# Altium schematic sheet 06_ETHERNET.SchDoc: RMII 10/100Mbps Ethernet
size 381 x 266 mm; Organization: Meteroi; Address1: Room 428, 410 Guiping Rd.; Address2: Shanghai 200233, CHINA; SheetNumber: 6; SheetTotal: 9; PageSetup: Record=PageOptions|CenterHorizontal=True|CenterVertical=True|PrintScale=0.75|XCorrection=1.00|YCorrection=1.00|PrintKind=2|BorderSize=5000000|LeftOffset=0|BottomOffset=0|Orientation=2|PaperLength=1000|PaperWidth=1000|Scale=100|PaperSource=276|PrintQuality=-3|MediaType=1|DitherType=10|PaperKind=A4|PrintScaleMode=1
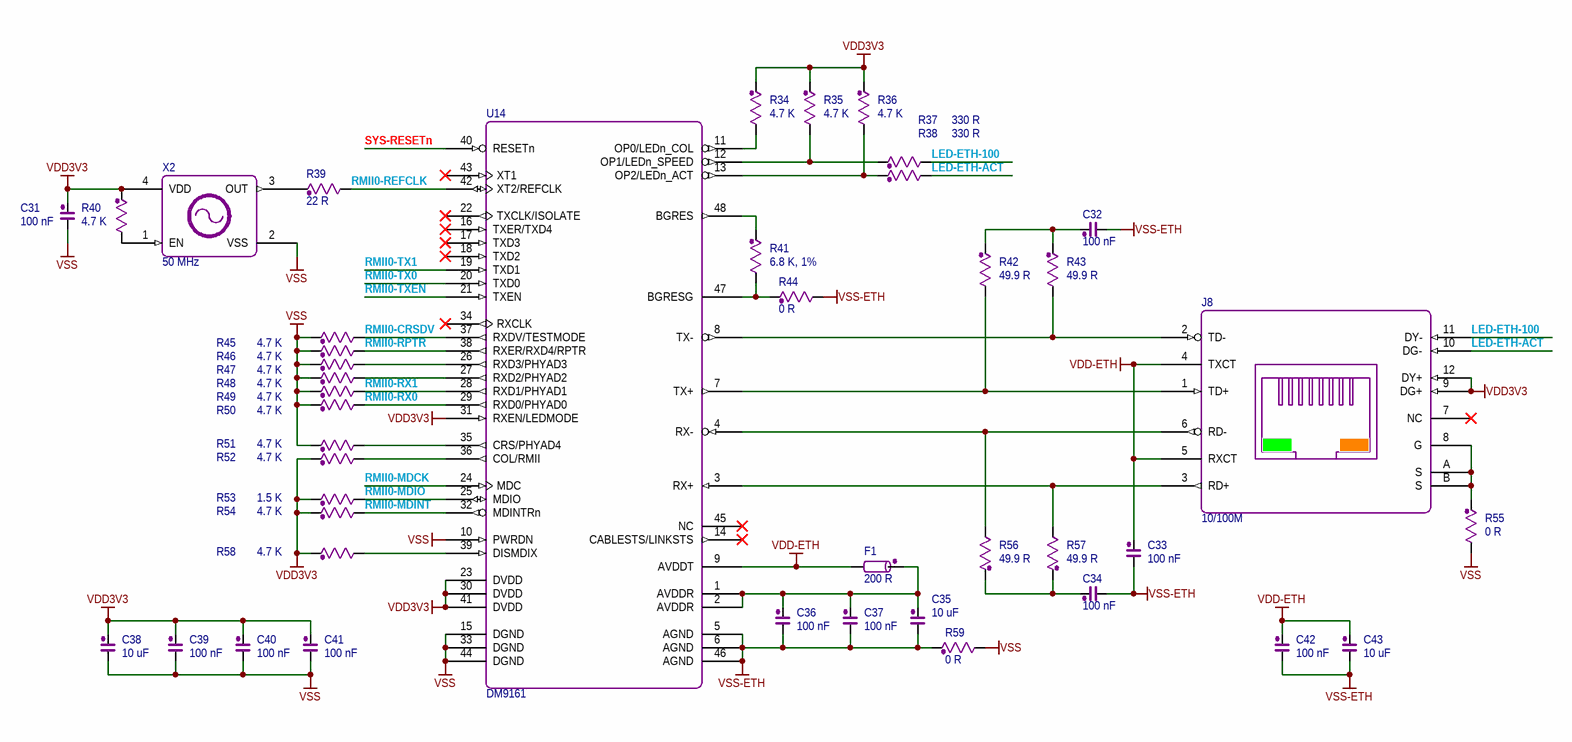
[diagram p0: 06_ETHERNET.SchDoc]

## Parts
C31  100 nF  [0402A1]
C32  100 nF  [0603A1]
C33  100 nF  [0603A1]
C34  100 nF  [0603A1]
C35  10 uF  [0603A1]
C36  100 nF  [0402A1]
C37  100 nF  [0402A1]
C38  10 uF  [0603A1]
C39  100 nF  [0402A1]
C40  100 nF  [0402A1]
C41  100 nF  [0402A1]
C42  100 nF  [0402A1]
C43  10 uF  [0603A1]
F1  200 R  [0603A3]
J8  10/100M  [RJ45_JACK_B]
R34  4.7 K  [0402A2]
R35  4.7 K  [0402A2]
R36  4.7 K  [0402A2]
R37  330 R  [0402A2]
R38  330 R  [0402A2]
R39  22 R  [0402A2]
R40  4.7 K  [0402A2]
R41  6.8 K, 1%  [0603A2]
R42  49.9 R  [0603A2]
R43  49.9 R  [0603A2]
R44  0 R  [0402A2]
R45  4.7 K  [0402A2]
R46  4.7 K  [0402A2]
R47  4.7 K  [0402A2]
R48  4.7 K  [0402A2]
R49  4.7 K  [0402A2]
R50  4.7 K  [0402A2]
R51  4.7 K  [0402A2]
R52  4.7 K  [0402A2]
R53  1.5 K  [0402A2]
R54  4.7 K  [0402A2]
R55  0 R  [0603A2]
R56  49.9 R  [0603A2]
R57  49.9 R  [0603A2]
R58  4.7 K  [0402A2]
R59  0 R  [0603A2]
U14  DM9161  [TQFP-48A]
X2  50 MHz  [OSC_4B_S_5032]

## Nets
VDD3V3: C31.2 C38.2 C39.2 C40.2 C41.2 J8.9(DG+) J8.12(DY+) R34.2 R35.2 R36.2 R40.2 R52.2 R53.2 R54.2 R58.2 U14.23(DVDD) U14.30(DVDD) U14.31(RXEN/LEDMODE) U14.41(DVDD) X2.4(VDD)
VDD-ETH: C33.2 C42.2 C43.2 F1.1 J8.4(TXCT) J8.5(RXCT) U14.9(AVDDT)
VSS: C31.1 C38.1 C39.1 C40.1 C41.1 R45.2 R46.2 R47.2 R48.2 R49.2 R50.2 R51.2 R55.1 R59.1 U14.10(PWRDN) U14.15(DGND) U14.33(DGND) U14.44(DGND) X2.2(VSS)
VSS-ETH: C32.1 C33.1 C34.1 C35.1 C36.1 C37.1 C42.1 C43.1 R44.1 R59.2 U14.5(AGND) U14.6(AGND) U14.46(AGND)
LED-ETH-100: J8.11(DY-) R37.1
LED-ETH-ACT: J8.10(DG-) R38.1
RMII0-CRSDV: R45.1 U14.37(RXDV/TESTMODE)
RMII0-MDCK: U14.24(MDC)
RMII0-MDINT: R54.1 U14.32(MDINTRn)
RMII0-MDIO: R53.1 U14.25(MDIO)
RMII0-REFCLK: R39.1 U14.42(XT2/REFCLK)
RMII0-RPTR: R46.1 U14.38(RXER/RXD4/RPTR)
RMII0-RX0: R50.1 U14.29(RXD0/PHYAD0)
RMII0-RX1: R49.1 U14.28(RXD1/PHYAD1)
RMII0-TX0: U14.20(TXD0)
RMII0-TX1: U14.19(TXD1)
RMII0-TXEN: U14.21(TXEN)
SYS-RESETn: U14.40(RESETn)
NetC32_2: C32.2 R42.2 R43.2
NetC34_2: C34.2 R56.2 R57.2
NetC35_2: C35.2 C36.2 C37.2 F1.2 U14.1(AVDDR) U14.2(AVDDR)
NetJ8_1: J8.1(TD+) R42.1 U14.7(TX+)
NetJ8_2: J8.2(TD-) R43.1 U14.8(TX-)
NetJ8_3: J8.3(RD+) R57.1 U14.3(RX+)
NetJ8_6: J8.6(RD-) R56.1 U14.4(RX-)
NetJ8_8: J8.8(G) J8.A(S) J8.B(S) R55.2
NetR34_1: R34.1 U14.11(OP0/LEDn_COL)
NetR35_1: R35.1 R37.2 U14.12(OP1/LEDn_SPEED)
NetR36_1: R36.1 R38.2 U14.13(OP2/LEDn_ACT)
NetR39_2: R39.2 X2.3(OUT)
NetR40_1: R40.1 X2.1(EN)
NetR41_1: R41.1 R44.2 U14.47(BGRESG)
NetR41_2: R41.2 U14.48(BGRES)
NetR47_1: R47.1 U14.26(RXD3/PHYAD3)
NetR48_1: R48.1 U14.27(RXD2/PHYAD2)
NetR51_1: R51.1 U14.35(CRS/PHYAD4)
NetR52_1: R52.1 U14.36(COL/RMII)
NetR58_1: R58.1 U14.39(DISMDIX)

Not connected (* = marked no-connect by the designer): J8 7(NC)*; U14 14(CABLESTS/LINKSTS)* 16(TXER/TXD4)* 17(TXD3)* 18(TXD2)* 22(TXCLK/ISOLATE)* 34(RXCLK)* 43(XT1)* 45(NC)*

## Notes on the sheet
- Title:
- Project:
- Sheet:
- Of
- Size:
- D/N:
- Rev:
- Date:
- P/N:
- S/N:
- Designer:
- C

## Library data of the parts
C31-C43 = CAP: Normal Capacitor; PartNumber: 0; Vendor: muRata; Designer: shyul; PinCountSMD: 2; SerialNumber: 0; Publisher: Cowin; PCBMarker: Capacitor; Version: 1.0; VersionDate: 04-27-2011; PinCountHole: 0
  C31-C34 C36 C37 C39-C42: Value: 100 nF
  C35 C38 C43: Value: 10 uF
F1 = BEAD: EMI Bead; PartNumber: BLM; SerialNumber: 0; Vendor: muRata; Designer: shyul; PinCountSMD: 2; PCBMarker: Bead; Version: 1.0; Value: 200 R; VersionDate: 04-28-2011; Publisher: Cowin; PinCountHole: 0
J8 = RJ45_JACK_B: RJ45 Pulse Jack with LED; PartNumber: J0011D21B; PCBMarker: 0; Designer: shyul; SerialNumber: 0; Vendor: Pulse; Version: 1.0; VersionDate: 07-05-2011; Value: 10/100M; Publisher: Cowin
R34-R59 = RES: Normal Resistor; PartNumber: 0; Vendor: KOA; Designer: shyul; PinCountSMD: 2; SerialNumber: 0; Version: 1.0; VersionDate: 04-27-2011; PCBMarker: Resistor; Publisher: Cowin; PinCountHole: 0
  R34-R36 R40 R45-R52 R54 R58: Value: 4.7 K
  R37 R38: Value: 330 R
  R39: Value: 22 R
  R41: Value: 6.8 K, 1%
  R42 R43 R56 R57: Value: 49.9 R
  R44 R55 R59: Value: 0 R
  R53: Value: 1.5 K
U14 = DM9161: DM9161 10/100M Ethernet PHY; PartNumber: DM9161AEP; Vendor: DAVICOM; PinCountSMD: 48; PinCountHole: 0; Designer: shyul; Value: DM9161; Version: 1.0; VersionDate: 03-26-2012; SerialNumber: 0; Publisher: Cowin; PCBMarker: PHY
X2 = OSC_4B: Crystal Oscillator; PartNumber: 0; Vendor: KDS; Designer: shyul; Value: 50 MHz; SerialNumber: 0; Publisher: Cowin; PCBMarker: Crystal Oscillator; Version: 1.0; VersionDate: 04-29-2011